# Altium schematic sheet Switching_schematic_2022-05-04.schdoc
size 284 x 181 mm
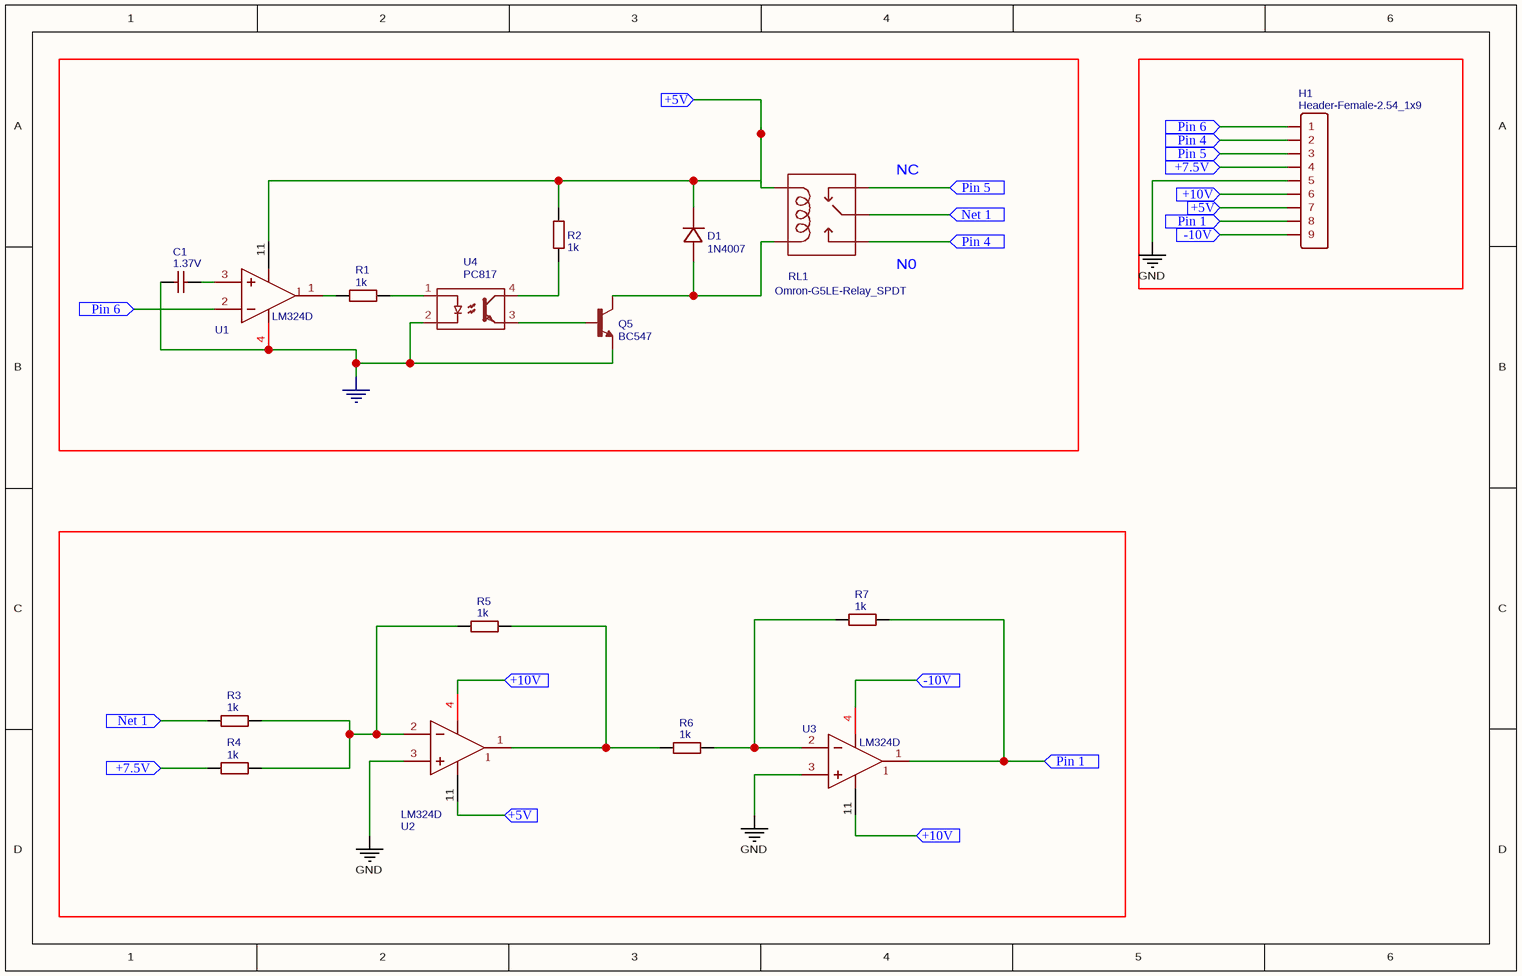
[diagram p0: Switching_schematic_2022-05-04.schdoc]

## Parts
C1  1.37V  [RAD-0.2]
D1  1N4007  [DO-15]
H1  Header-Female-2.54_1x9  [HDR-TH_9P-P2.54-V-F-1]
Q5  BC547  [TO-92]
R1  1k  [AXIAL-0.4]
R2  1k  [AXIAL-0.4]
R3  1k  [AXIAL-0.4]
R4  1k  [AXIAL-0.4]
R5  1k  [AXIAL-0.4]
R6  1k  [AXIAL-0.4]
R7  1k  [AXIAL-0.4]
RL1  Omron-G5LE-Relay_SPDT  [OMRON_G5LE_SPDT_RELAY]
U1  LM324D  [SO-14_L8.9-W3.9-P1.27-LS6.0-BL]
U2  LM324D  [SO-14_L8.9-W3.9-P1.27-LS6.0-BL]
U3  LM324D  [SO-14_L8.9-W3.9-P1.27-LS6.0-BL]
U4  PC817  [DIP4]

## Ports
+5V (in), +7.5V (in), +10V (in), -10V (in), Net 1 (in), Pin 1 (in), Pin 4 (in), Pin 5 (in), Pin 6 (in)

## Nets
GND: C1.1 H1.5 Q5.3(E) U1.4(VCC+) U2.3(IN1+) U3.3(IN1+) U4.2
+5V: D1.2(C) H1.7 R2.2 RL1.2(COIL2) U1.11(VCC-) U2.11(VCC-) ; port +5V
+7.5V: H1.4 R4.2 ; port +7.5V
+10V: H1.6 U2.4(VCC+) U3.11(VCC-) ; port +10V
-10V: H1.9 U3.4(VCC+) ; port -10V
Net 1: R3.2 RL1.1(MAIN) ; port Net 1
Pin 1: H1.8 R7.1 U3.1(OUT1) ; port Pin 1
Pin 4: H1.2 RL1.3(NO) ; port Pin 4
Pin 5: H1.3 RL1.4(NC) ; port Pin 5
Pin 6: H1.1 U1.2(IN1-) ; port Pin 6
NetC1_2: C1.2 U1.3(IN1+)
NetD1_1: D1.1(A) Q5.1(C) RL1.5(COIL1)
NetQ5_2: Q5.2(B) U4.3
NetR1_1: R1.1 U4.1
NetR1_2: R1.2 U1.1(OUT1)
NetR2_1: R2.1 U4.4
NetR3_1: R3.1 R4.1 R5.2 U2.2(IN1-)
NetR5_1: R5.1 R6.2 U2.1(OUT1)
NetR6_1: R6.1 R7.2 U3.2(IN1-)

## Notes on the sheet
- (near RL1) NC
- (near RL1) N0

## Library data of the parts
C1 = 1.37V: BOM_Manufacturer: LCSC; BOM_Manufacturer Part: 0.1UF(104) +-20% 63v; Value: 100nF; BOM_Supplier: LCSC; BOM_Supplier Part: C19355; spicePre: C; spiceSymbolName: 100nF
D1 = 1N4007: nameAlias: Model; BOM_Manufacturer Part: ?; spicePre: D; spiceSymbolName: Diode
H1 = Header-Female-2.54_1x9: BOM_Manufacturer: BOOMELE; BOM_Manufacturer Part: 2.54mm 1*9 Straight Female header; BOM_Supplier: LCSC; BOM_Supplier Part: C39576; BOM_JLCPCB Part Class: Extended Part; spicePre: H; spiceSymbolName: Header-Female-2.54_1x9
Q5 = BC547: catid: 20; description: Generic NPN BJT; Contributor: SparkFun; sourceId: m0Xx7trpY; BOM_Manufacturer Part: ?; spicePre: Q
R1-R7 = 1k: BOM_Manufacturer: UniOhm; BOM_Manufacturer Part: MFR0W4F2200A50; Power: 1/4W; Tolerance: ±1%; BOM_EasyEDA: E57439; Value: Value; BOM_Supplier Part: E57439; BOM_Supplier: EasyEDA; spicePre: R; spiceSymbolName: RESISTOR
RL1 = Omron-G5LE-Relay_SPDT: catid: 20; sourceId: 8212Wkfjh; BOM_Manufacturer Part: ?; spicePre: R
U1-U3 = LM324D: BOM_Manufacturer: ST(意法半导体); subpart_no: 1; Contributor: LCSC; BOM_Supplier: LCSC; BOM_Supplier Part: C2935189; BOM_Manufacturer Part: LM324D; spicePre: U; spiceSymbolName: LM324D
U4 = PC817: catid: 20; sourceId: W20mH3pL7; BOM_Manufacturer Part: ?; spicePre: U